# Altium schematic sheet open-rally-computer.schdoc
size 411 x 275 mm
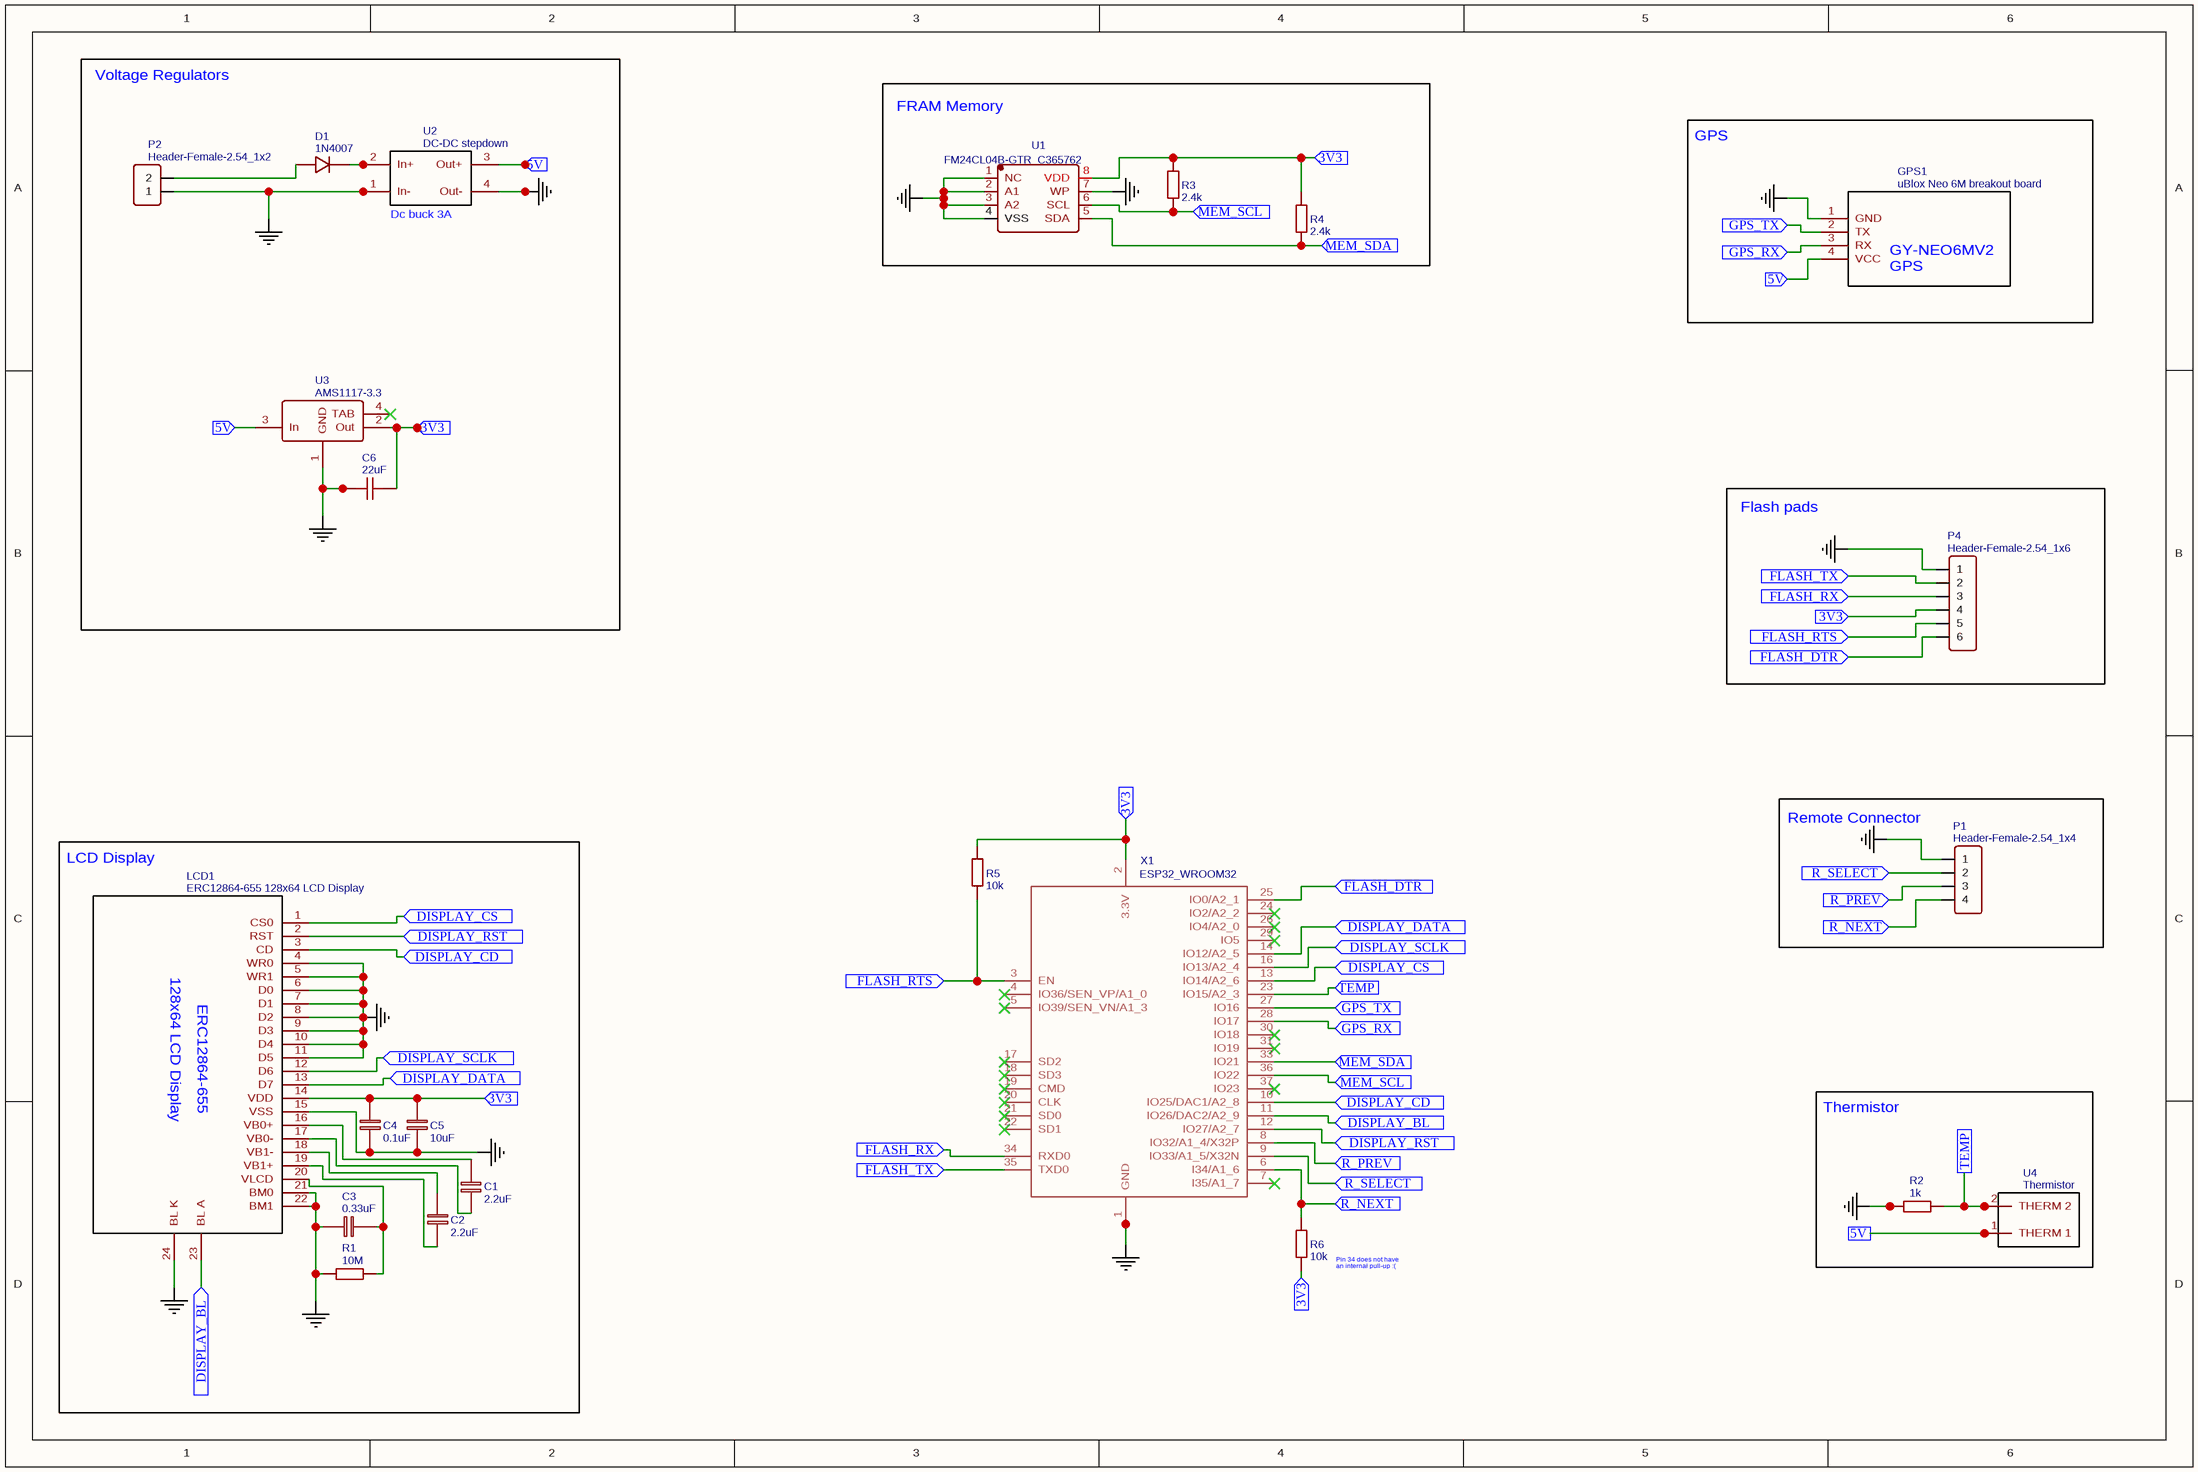
[diagram p0: open-rally-computer.schdoc]

## Parts
C1  2.2uF  [1206]
C2  2.2uF  [1206]
C3  0.33uF  [1206]
C4  0.1uF  [1206]
C5  10uF  [1206]
C6  22uF  [1206]
D1  1N4007  [SOD-123F]
GPS1  uBlox Neo 6M breakout board  [GY-NEO6MV2]
LCD1  ERC12864-655 128x64 LCD Display  [ERC12864-655]
P1  Header-Female-2.54_1x4  [HDR-4X1/2.54]
P2  Header-Female-2.54_1x2  [HDR-1X2/2.54]
P4  Header-Female-2.54_1x6  [HDR-6X1/2.54]
R1  10M  [1206]
R2  1k  [1206]
R3  2.4k  [1206]
R4  2.4k  [1206]
R5  10k  [1206]
R6  10k  [1206]
U1  FM24CL04B-GTR_C365762  [SOIC-8_150MIL]
U2  DC-DC stepdown  [DC-DC STEPDOWN]
U3  AMS1117-3.3  [SOT-223]
U4  Thermistor  [THERMISTOR-PCB]
X1  ESP32_WROOM32  [WROOM32]

## Blocks framed on the sheet
Voltage Regulators: C6 D1 P2 U2 U3
FRAM Memory: R3 R4 U1
GPS: GPS1
Flash pads: P4
LCD Display: C1-C5 LCD1 R1
Remote Connector: P1
Thermistor: R2 U4

## Ports
3V3 (in), 5V (in), DISPLAY_BL (in), DISPLAY_CD (in), DISPLAY_CS (in), DISPLAY_DATA (in), DISPLAY_RST (in), DISPLAY_SCLK (in), FLASH_DTR (in), FLASH_RTS (in), FLASH_RX (in), FLASH_TX (in), GPS_RX (in), GPS_TX (in), MEM_SCL (in), MEM_SDA (in), R_NEXT (in), R_PREV (in), R_SELECT (in), TEMP (in)

## Nets
GND: C3.1 C4.2 C5.2 C6.1 GPS1.1(GND) LCD1.4(WR0) LCD1.5(WR1) LCD1.6(D0) LCD1.7(D1) LCD1.8(D2) LCD1.9(D3) LCD1.10(D4) LCD1.11(D5) LCD1.15(VSS) LCD1.21(BM0) LCD1.22(BM1) LCD1.24(BL_K) P1.1 P2.1 P4.1 R1.1 R2.1 U1.1(NC) U1.2(A1) U1.3(A2) U1.4(VSS) U1.7(WP) U2.1(In-) U2.4(Out-) U3.1(GND) X1.1(GND) X1.15(GND) X1.38(GND) X1.P$1(GND)
3V3: C4.1 C5.1 C6.2 LCD1.14(VDD) P4.4 R3.2 R4.2 R5.2 R6.1 U1.8(VDD) U3.2(Out) X1.2(3.3V) ; port 3V3
5V: GPS1.4(VCC) U2.3(Out+) U3.3(In) U4.1(THERM_1) ; port 5V
DISPLAY_BL: LCD1.23(BL_A) X1.11(IO26/DAC2/A2_9) ; port DISPLAY_BL
DISPLAY_CD: LCD1.3(CD) X1.10(IO25/DAC1/A2_8) ; port DISPLAY_CD
DISPLAY_CS: LCD1.1(CS0) X1.13(IO14/A2_6) ; port DISPLAY_CS
DISPLAY_DATA: LCD1.13(D7) X1.14(IO12/A2_5) ; port DISPLAY_DATA
DISPLAY_RST: LCD1.2(RST) X1.12(IO27/A2_7) ; port DISPLAY_RST
DISPLAY_SCLK: LCD1.12(D6) X1.16(IO13/A2_4) ; port DISPLAY_SCLK
FLASH_DTR: P4.6 X1.25(IO0/A2_1) ; port FLASH_DTR
FLASH_RTS: P4.5 R5.1 X1.3(EN) ; port FLASH_RTS
FLASH_RX: P4.3 X1.34(RXD0) ; port FLASH_RX
FLASH_TX: P4.2 X1.35(TXD0) ; port FLASH_TX
GPS_RX: GPS1.3(RX) X1.28(IO17) ; port GPS_RX
GPS_TX: GPS1.2(TX) X1.27(IO16) ; port GPS_TX
MEM_SCL: R3.1 U1.6(SCL) X1.36(IO22) ; port MEM_SCL
MEM_SDA: R4.1 U1.5(SDA) X1.33(IO21) ; port MEM_SDA
R_NEXT: P1.4 R6.2 X1.6(I34/A1_6) ; port R_NEXT
R_PREV: P1.3 X1.8(IO32/A1_4/X32P) ; port R_PREV
R_SELECT: P1.2 X1.9(IO33/A1_5/X32N) ; port R_SELECT
TEMP: R2.2 U4.2(THERM_2) X1.23(IO15/A2_3) ; port TEMP
NetC1_1: C1.1 LCD1.17(VB0-)
NetC1_2: C1.2 LCD1.16(VB0+)
NetC2_1: C2.1 LCD1.18(VB1-)
NetC2_2: C2.2 LCD1.19(VB1+)
NetC3_2: C3.2 LCD1.20(VLCD) R1.2
NetD1_1: D1.1(+) P2.2
NetD1_2: D1.2(-) U2.2(In+)

Not connected (* = marked no-connect by the designer): U3 4(TAB)*; X1 4(IO36/SEN_VP/A1_0)* 5(IO39/SEN_VN/A1_3)* 7(I35/A1_7)* 17(SD2)* 18(SD3)* 19(CMD)* 20(CLK)* 21(SD0)* 22(SD1)* 24(IO2/A2_2)* 26(IO4/A2_0)* 29(IO5)* 30(IO18)* 31(IO19)* 37(IO23)*

## Notes on the sheet
- (near R6) Pin 34 does not have
  an internal pull-up :(
- (in symbol DC-DC stepdown) Dc buck 3A
- (in symbol ERC12864-655 128x64 LCD Display) 128x64 LCD Display
- (in symbol uBlox Neo 6M breakout board) GY-NEO6MV2 / GPS

## Library data of the parts
C1 C2 = 2.2uF: nameAlias: Value(F); BOM_Manufacturer Part: ?; spicePre: C; spiceSymbolName: Cap_1206_EU
C3 = 0.33uF: nameAlias: Value(F); BOM_Manufacturer Part: ?; spicePre: C; spiceSymbolName: Cap_1206_EU
C4 = 0.1uF: nameAlias: Value(F); BOM_Manufacturer Part: ?; spicePre: C; spiceSymbolName: Cap_1206_EU
C5 = 10uF: nameAlias: Value(F); BOM_Manufacturer Part: ?; spicePre: C; spiceSymbolName: Cap_1206_EU
C6 = 22uF: BOM_Manufacturer: FH; BOM_Manufacturer Part: 1206B226K160NT; nameAlias: Capacitance; BOM_Supplier: LCSC; BOM_Supplier Part: C31847; spicePre: C; spiceSymbolName: 1206B226K160NT
D1 = 1N4007: BOM_Manufacturer: Hottech; Contributor: LCSC; BOM_Supplier Part: C181127; BOM_Supplier: LCSC; BOM_Manufacturer Part: 1N4007; spicePre: D
GPS1 = uBlox Neo 6M breakout board: Contributor: mattogodoy; BOM_Manufacturer Part: GY-NEO6MV2; BOM_Supplier Part: GY-NEO6MV2; spicePre: G
LCD1 = ERC12864-655 128x64 LCD Display: BOM_Manufacturer: EastRising Technology Co.; Contributor: mattogodoy; BOM_Manufacturer Part: ERC12864-655; BOM_Supplier: BuyDisplay.com; BOM_Supplier Part: ERC12864-655; link: https://www.buydisplay.com/download/manual/ERC12864-655_Series_Datasheet.pdf; spicePre: L
P1 = Header-Female-2.54_1x4: BOM_Manufacturer: ReliaPro; BOM_Supplier: LCSC; BOM_Manufacturer Part: Header-Female-2.54_1x4; BOM_Supplier Part: C124413; spicePre: P
P2 = Header-Female-2.54_1x2: BOM_Manufacturer: BOOMELE; BOM_Manufacturer Part: 2.54-1*2PFemale; Contributor: LCSC; BOM_Supplier: LCSC; image: //image.lceda.cn/szlcsc/C49661.jpg; BOM_Supplier Part: C49661; spicePre: P
P4 = Header-Female-2.54_1x6: BOM_Manufacturer: BOOMELE; BOM_Manufacturer Part: Female header 1*6p; BOM_Supplier: LCSC; BOM_Supplier Part: C40877; spicePre: P
R1 = 10M: nameAlias: Value(Ω); BOM_Manufacturer Part: ?; spicePre: R; spiceSymbolName: Res_1206(1/4W)_EU
R2 = 1k: nameAlias: Value(Ω); BOM_Manufacturer Part: ?; spicePre: R; spiceSymbolName: Res_1206(1/4W)_EU
R3 R4 = 2.4k: nameAlias: Value(Ω); BOM_Manufacturer Part: ?; spicePre: R; spiceSymbolName: Res_1206(1/4W)_EU
R5 R6 = 10k: nameAlias: Value(Ω); BOM_Manufacturer Part: ?; spicePre: R; spiceSymbolName: Res_1206(1/4W)_EU
U1 = FM24CL04B-GTR_C365762: BOM_Manufacturer: Cypress Semicon; Contributor: LCSC; BOM_Supplier: LCSC; BOM_Supplier Part: C365762; BOM_Manufacturer Part: FM24CL04B-GTR; spicePre: U
U2 = DC-DC stepdown: Contributor: willumpie; sourceId: mJx7RnvtA; timeStamp: 1472643348; BOM_Manufacturer Part: ?; spicePre: U
U3 = AMS1117-3.3: BOM_Manufacturer: AMS; sourceId: dwIGgezVh; timeStamp: 1476261164; BOM_Supplier: LCSC; BOM_Manufacturer Part: AMS1117-3.3; BOM_LCSC Assembly: Yes; image: //image.lceda.cn/szlcsc/C6186.jpg; BOM_Supplier Part: C6186; spicePre: U
U4 = Thermistor: Contributor: xstaticgrey; timeStamp: 1468783036; BOM_Manufacturer Part: ?; spicePre: U
X1 = ESP32_WROOM32: Contributor: meggawatts; BOM_Manufacturer Part: ?; spicePre: X